# EAGLE schematic adcUart (EAGLE 7.1.0)
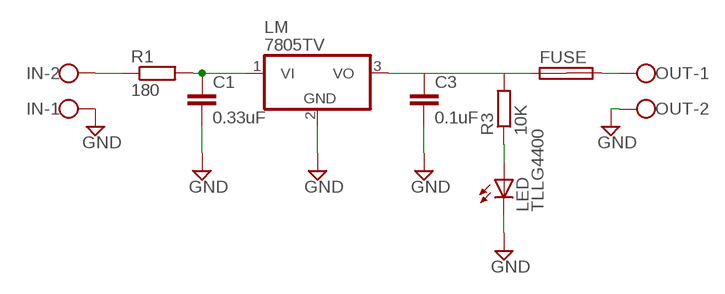
[diagram p0: schematic, sheet 1]

## Parts
C1  0.33uF  C-EU025-024X044  [C025-024X044]
C3  0.1uF  C-EU025-024X044  [C025-024X044]
FUSE  SHK20L  [SHK20L]
IN  W237-102  [W237-102]
LED  TLLG4400  [LED3MM]
LM  7805TV  [TO220V]
OUT  W237-102  [W237-102]
R1  180  R-EU_0617/22  [0617/22]
R3  10K  R-EU_0204/7  [0204/7]

## Nets
GND: C1.2 C3.2 IN.1 LED.K(C) LM.2(GND) OUT.2
N$1: IN.2 R1.1
N$2: FUSE.2A OUT.1
N$3: C1.1 LM.1(VI) R1.2
N$5: C3.1 FUSE.1A LM.3(VO) R3.2
N$6: LED.A R3.1
Unconnected: FUSE.1B FUSE.2B

## Library data of the parts
C1 C3 = rcl:C-EU: CAPACITOR, European symbol
FUSE = fuse:SHK20L: FUSE HOLDER 5 x 20 mm, SH contact, SHH1 Schukat, E1073 Buerklin; OC_FARNELL: unknown; OC_NEWARK: unknown
IN OUT = con-wago-500:W237-102: WAGO SCREW CLAMP; MPN: 237-102; OC_FARNELL: unknown; OC_NEWARK: 70K9898
LED = led:TLLG4400: Low Current (2mA) LED 3 mm Tinted Diffused Package color GREEN Source: Data sheet <http://www.farnell.com/datasheets/391098.pdf>; MF: VISHAY SEMICONDUCTOR; OC_FARNELL: 1612435
LM = linear:78*: Positive VOLTAGE REGULATOR Source: http://cache.national.com/ds/LM/LM78L05.pdf http://www.fairchildsemi.com/ds/LM/LM7805.pdf
R1 = resistor:R-EU_: RESISTOR, European symbol
R3 = rcl:R-EU_: RESISTOR, European symbol